# Altium schematic sheet UPS.SchDoc (part 1 of 4)
size 381 x 241 mm; SheetNumber: 1; SheetTotal: 1
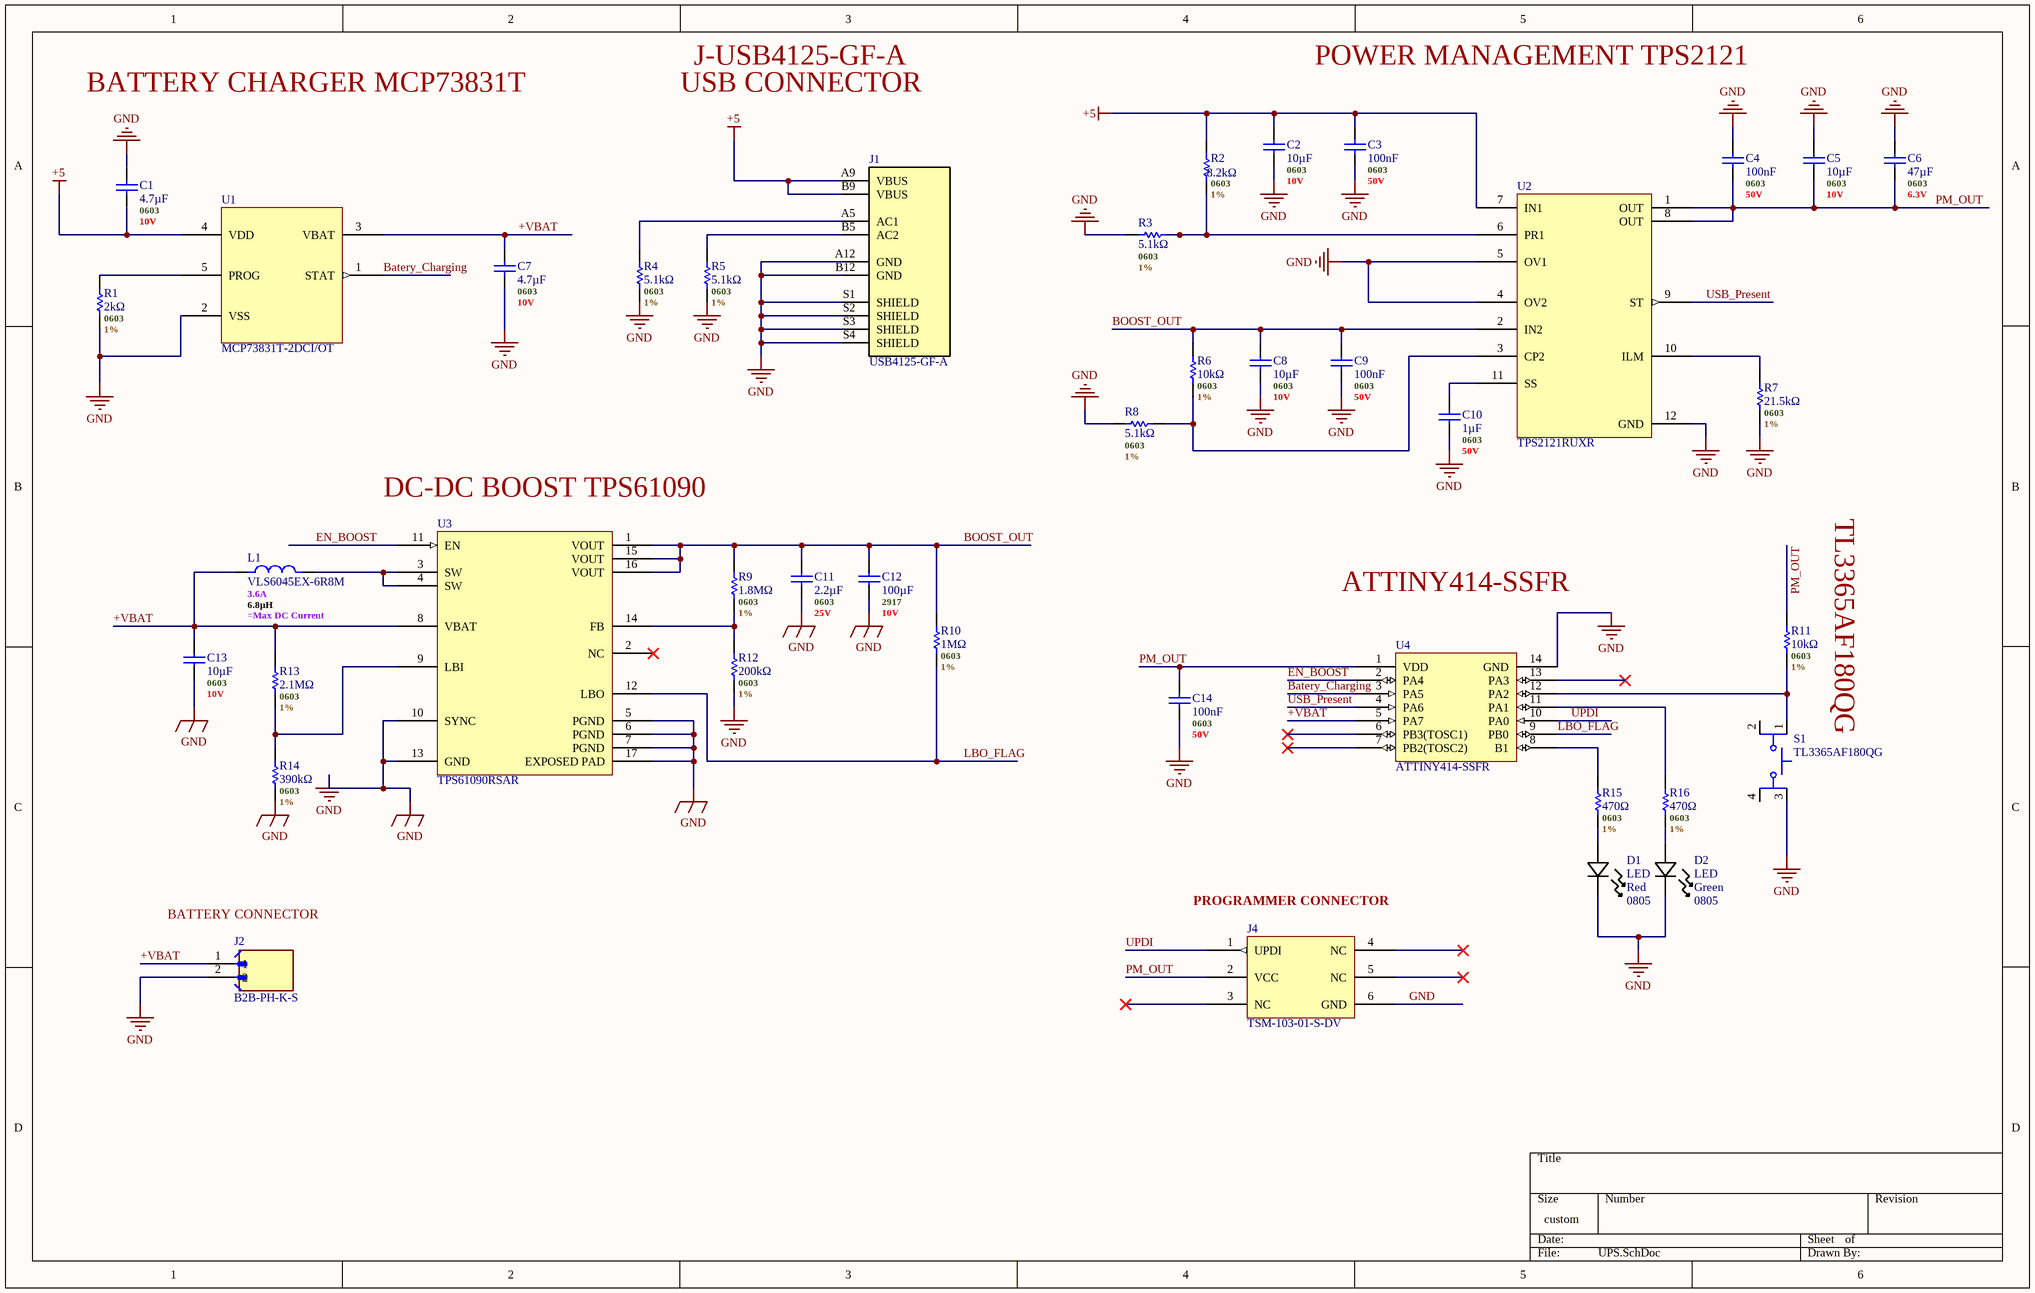
[diagram p0: UPS.SchDoc]

## Parts
C1  4.7µF  .Case/Package: 0603  .Voltage Rating (DC): 10V  [C0603 - MURATA]
C2  10µF  .Case/Package: 0603  .Voltage Rating (DC): 10V  [C0603 - MURATA]
C3  100nF  .Case/Package: 0603  .Voltage Rating (DC): 50V  [C0603 - MURATA]
C4  100nF  .Case/Package: 0603  .Voltage Rating (DC): 50V  [C0603 - MURATA]
C5  10µF  .Case/Package: 0603  .Voltage Rating (DC): 10V  [C0603 - MURATA]
C6  47µF  .Case/Package: 0603  .Voltage Rating (DC): 6.3V  [C0603 - MURATA]
C7  4.7µF  .Case/Package: 0603  .Voltage Rating (DC): 10V  [C0603 - MURATA]
C8  10µF  .Case/Package: 0603  .Voltage Rating (DC): 10V  [C0603 - MURATA]
C9  100nF  .Case/Package: 0603  .Voltage Rating (DC): 50V  [C0603 - MURATA]
C10  1µF  .Case/Package: 0603  .Voltage Rating (DC): 50V  [C0603 - MURATA]
C11  2.2µF  .Case/Package: 0603  .Voltage Rating (DC): 25V  [C0603 - MURATA]
C12  100µF  .Case/Package: 2917  .Voltage Rating (DC): 10V  [CAPPM7343X310N]
C13  10µF  .Case/Package: 0603  .Voltage Rating (DC): 10V  [C0603 - MURATA]
C14  100nF  .Case/Package: 0603  .Voltage Rating (DC): 50V  [C0603 - MURATA]
D1  LED  .Color: Red  .Case/Package: 0805  [D0805 - LOI]
D2  LED  .Color: Green  .Case/Package: 0805  [D0805 - LOI]
J1  USB4125-GF-A  [GCT_USB4125-GF-A_REVA2]
J2  B2B-PH-K-S  [JST_B2B-PH-K-S]
J4  TSM-103-01-S-DV  [TSM-103-01-S-DV - SAMTEC]
L1  VLS6045EX-6R8M  .RMS Current (Irms): 3.6A  .Value: 6.8µH  [IND_VLS6045EX-6R8M]
R1  2kΩ  .Case/Package: 0603  .Tolerance: 1%  [R0603 - YAGEO]
R2  8.2kΩ  .Case/Package: 0603  .Tolerance: 1%  [R0603 - YAGEO]
R3  5.1kΩ  .Case/Package: 0603  .Tolerance: 1%  [R0603 - YAGEO]
R4  5.1kΩ  .Case/Package: 0603  .Tolerance: 1%  [R0603 - YAGEO]
R5  5.1kΩ  .Case/Package: 0603  .Tolerance: 1%  [R0603 - YAGEO]
R6  10kΩ  .Case/Package: 0603  .Tolerance: 1%  [R0603 - YAGEO]
R7  21.5kΩ  .Case/Package: 0603  .Tolerance: 1%  [R0603 - YAGEO]
R8  5.1kΩ  .Case/Package: 0603  .Tolerance: 1%  [R0603 - YAGEO]
R9  1.8MΩ  .Case/Package: 0603  .Tolerance: 1%  [R0603 - YAGEO]
R10  1MΩ  .Case/Package: 0603  .Tolerance: 1%  [R0603 - YAGEO]
R11  10kΩ  .Case/Package: 0603  .Tolerance: 1%  [R0603 - YAGEO]
R12  200kΩ  .Case/Package: 0603  .Tolerance: 1%  [R0603 - YAGEO]
R13  2.1MΩ  .Case/Package: 0603  .Tolerance: 1%  [R0603 - YAGEO]
R14  390kΩ  .Case/Package: 0603  .Tolerance: 1%  [R0603 - YAGEO]
R15  470Ω  .Case/Package: 0603  .Tolerance: 1%  [R0603 - YAGEO]
R16  470Ω  .Case/Package: 0603  .Tolerance: 1%  [R0603 - YAGEO]
S1  TL3365AF180QG  [SW_TL3365AF180QG]
U1  MCP73831T-2DCI/OT  [SOT-23-5 - Microchip V2]
U2  TPS2121RUXR  [12-QFN]
U3  TPS61090RSAR  [16-QFN-TI]
U4  ATTINY414-SSFR  [14-SOIC - MT V2]

## Nets
+5: C1.2 C2.1 C3.2 J1.A9(VBUS) J1.B9(VBUS) R2.2 U1.4(VDD) U2.7(IN1)
GND: C1.1 C2.2 C3.1 C4.2 C5.1 C6.2 C7.2 C8.2 C9.1 C10.2 C11.2 C12.2 C13.2 C14.1 D1.1 D2.1 J1.A12(GND) J1.B12(GND) J1.S1(SHIELD) J1.S2(SHIELD) J1.S3(SHIELD) J1.S4(SHIELD) J2.2 J4.6(GND) R1.1 R3.2 R4.2 R5.2 R7.2 R8.2 R12.2 R14.2 S1.3 U1.2(VSS) U2.4(OV2) U2.5(OV1) U2.12(GND) U3.5(PGND) U3.6(PGND) U3.7(PGND) U3.10(SYNC) U3.13(GND) U3.17(EXPOSED_PAD) U4.14(GND)
+VBAT: C7.1 C13.1 J2.1 L1.1 R13.1 U1.3(VBAT) U3.8(VBAT) U4.5(PA7)
Batery_Charging: U1.1(STAT) U4.3(PA5)
BOOST_OUT: C8.1 C9.2 C11.1 C12.1 R6.2 R9.1 R10.1 U2.2(IN2) U3.1(VOUT) U3.15(VOUT) U3.16(VOUT)
EN_BOOST: U3.11(EN) U4.2(PA4)
LBO_FLAG: R10.2 U3.12(LBO) U4.9(PB0)
PM_OUT: C4.1 C5.2 C6.1 C14.2 J4.2(VCC) R11.1 U2.1(OUT) U2.8(OUT) U4.1(VDD)
UPDI: J4.1(UPDI) U4.10(PA0)
USB_Present: U2.9(ST) U4.4(PA6)
NetC10_1: C10.1 U2.11(SS)
NetD1_2: D1.2 R15.2
NetD2_2: D2.2 R16.2
NetJ1_A5: J1.A5(AC1) R4.1
NetJ1_B5: J1.B5(AC2) R5.1
NetL1_2: L1.2 U3.3(SW) U3.4(SW)
NetR1_2: R1.2 U1.5(PROG)
NetR2_1: R2.1 R3.1 U2.6(PR1)
NetR6_1: R6.1 R8.1 U2.3(CP2)
NetR7_1: R7.1 U2.10(ILM)
NetR9_2: R9.2 R12.1 U3.14(FB)
NetR11_2: R11.2 S1.1 U4.12(PA2)
NetR13_2: R13.2 R14.1 U3.9(LBI)
NetR15_1: R15.1 U4.8(B1)
NetR16_1: R16.1 U4.11(PA1)

Not connected (* = marked no-connect by the designer): J4 3(NC)* 4(NC)* 5(NC)*; S1 2 4; U3 2(NC)*; U4 6(PB3(TOSC1))* 7(PB2(TOSC2))* 13(PA3)*

## Notes on the sheet
- BATTERY CHARGER MCP73831T
- USB CONNECTOR
- J-USB4125-GF-A
- POWER MANAGEMENT TPS2121
- (near U3) DC-DC BOOST TPS61090
- TL3365AF180QG
- ATTINY414-SSFR
- (near J4) PROGRAMMER CONNECTOR
- (near J2) BATTERY CONNECTOR